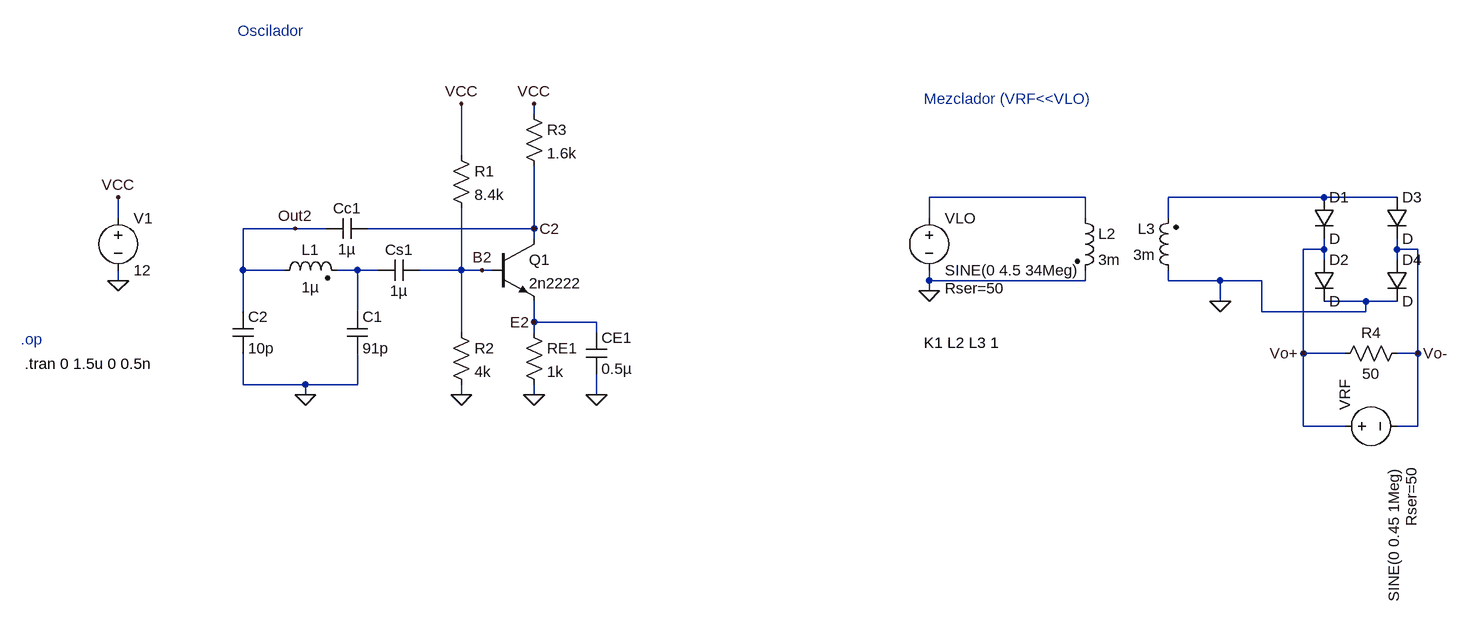
[diagram p0: schematic Draft2.asc]
Draft2.asc, the LTspice schematic file:
Version 4
SHEET 1 2084 680
WIRE 688 -80 688 -96
WIRE 576 -16 576 -96
WIRE 1536 48 1296 48
WIRE 1904 48 1664 48
WIRE 2016 48 1904 48
WIRE 48 80 48 48
WIRE 1296 80 1296 48
WIRE 1536 80 1536 48
WIRE 1664 80 1664 48
WIRE 320 96 240 96
WIRE 368 96 320 96
WIRE 688 96 688 0
WIRE 688 96 432 96
WIRE 688 112 688 96
WIRE 1904 128 1904 112
WIRE 1904 128 1872 128
WIRE 2016 128 2016 112
WIRE 2048 128 2016 128
WIRE 1904 144 1904 128
WIRE 2016 144 2016 128
WIRE 240 160 240 96
WIRE 304 160 240 160
WIRE 416 160 384 160
WIRE 448 160 416 160
WIRE 576 160 576 64
WIRE 576 160 512 160
WIRE 608 160 576 160
WIRE 624 160 608 160
WIRE 48 176 48 160
WIRE 1296 176 1296 160
WIRE 1536 176 1536 160
WIRE 1536 176 1296 176
WIRE 1664 176 1664 160
WIRE 1744 176 1664 176
WIRE 1808 176 1744 176
WIRE 1296 192 1296 176
WIRE 1744 208 1744 176
WIRE 1968 208 1904 208
WIRE 2016 208 1968 208
WIRE 240 224 240 160
WIRE 416 224 416 160
WIRE 1808 224 1808 176
WIRE 1968 224 1968 208
WIRE 1968 224 1808 224
WIRE 688 240 688 208
WIRE 784 240 688 240
WIRE 576 256 576 160
WIRE 688 256 688 240
WIRE 784 256 784 240
WIRE 1872 288 1872 128
WIRE 1936 288 1872 288
WIRE 2048 288 2048 128
WIRE 2048 288 2016 288
WIRE 240 336 240 288
WIRE 336 336 240 336
WIRE 416 336 416 288
WIRE 416 336 336 336
WIRE 336 352 336 336
WIRE 576 352 576 336
WIRE 688 352 688 336
WIRE 784 352 784 320
WIRE 1872 400 1872 288
WIRE 1936 400 1872 400
WIRE 2048 400 2048 288
WIRE 2048 400 2016 400
FLAG 48 176 0
FLAG 48 48 VCC
FLAG 576 352 0
FLAG 688 352 0
FLAG 576 -96 VCC
FLAG 688 -96 VCC
FLAG 336 352 0
FLAG 688 96 C2
FLAG 608 160 B2
FLAG 688 240 E2
FLAG 784 352 0
FLAG 320 96 Out2
FLAG 1296 192 0
FLAG 1744 208 0
FLAG 1872 288 Vo+
FLAG 2048 288 Vo-
SYMBOL voltage 48 64 R0
WINDOW 123 0 0 Left 0
WINDOW 39 0 0 Left 0
SYMATTR InstName V1
SYMATTR Value 12
SYMBOL npn 624 112 R0
SYMATTR InstName Q1
SYMATTR Value 2n2222
SYMBOL res 560 -32 R0
SYMATTR InstName R1
SYMATTR Value 8.4k
SYMBOL res 560 240 R0
SYMATTR InstName R2
SYMATTR Value 4k
SYMBOL res 672 240 R0
SYMATTR InstName RE1
SYMATTR Value 1k
SYMBOL cap 432 80 R90
WINDOW 0 0 32 VBottom 2
WINDOW 3 32 32 VTop 2
SYMATTR InstName Cc1
SYMATTR Value 1µ
SYMBOL cap 512 144 R90
WINDOW 0 0 32 VBottom 2
WINDOW 3 32 32 VTop 2
SYMATTR InstName Cs1
SYMATTR Value 1µ
SYMBOL cap 400 224 R0
SYMATTR InstName C1
SYMATTR Value 91p
SYMBOL ind2 288 176 R270
WINDOW 0 32 56 VTop 2
WINDOW 3 5 56 VBottom 2
SYMATTR InstName L1
SYMATTR Value 1µ
SYMATTR Type ind
SYMATTR SpiceLine Rser=1
SYMBOL cap 224 224 R0
SYMATTR InstName C2
SYMATTR Value 10p
SYMBOL cap 768 256 R0
SYMATTR InstName CE1
SYMATTR Value 0.5µ
SYMBOL res 672 -96 R0
SYMATTR InstName R3
SYMATTR Value 1.6k
SYMBOL ind2 1520 64 R0
SYMATTR InstName L2
SYMATTR Value 3m
SYMATTR Type ind
SYMBOL ind2 1680 176 R180
WINDOW 0 36 80 Left 2
WINDOW 3 36 40 Left 2
SYMATTR InstName L3
SYMATTR Value 3m
SYMATTR Type ind
SYMBOL voltage 1296 64 R0
WINDOW 123 0 0 Left 0
WINDOW 39 24 124 Left 2
SYMATTR InstName VLO
SYMATTR Value SINE(0 4.5 34Meg)
SYMATTR SpiceLine Rser=50
SYMBOL diode 1888 48 R0
SYMATTR InstName D1
SYMBOL diode 1888 144 R0
SYMATTR InstName D2
SYMBOL diode 2000 48 R0
SYMATTR InstName D3
SYMBOL diode 2000 144 R0
SYMATTR InstName D4
SYMBOL voltage 1920 400 R270
WINDOW 3 -270 91 Left 2
WINDOW 123 0 0 Left 0
WINDOW 39 -155 118 Left 2
SYMATTR InstName VRF
SYMATTR Value SINE(0 0.45 1Meg)
SYMATTR SpiceLine Rser=50
SYMBOL res 2032 272 R90
WINDOW 0 0 56 VBottom 2
WINDOW 3 32 56 VTop 2
SYMATTR InstName R4
SYMATTR Value 50
TEXT -102 266 Left 2 ;.op
TEXT -96 304 Left 2 !.tran 0 1.5u 0 0.5n
TEXT 1288 272 Left 2 !K1 L2 L3 1
TEXT 232 -208 Left 2 ;Oscilador
TEXT 1288 -104 Left 2 ;Mezclador (VRF<<VLO)

The netlist it stands for:
* Draft2.asc
V1 VCC 0 12
Q1 C2 B2 E2 0 2n2222
R1 VCC B2 8.4k
R2 B2 0 4k
RE1 E2 0 1k
Cc1 C2 Out2 1µ
Cs1 B2 N003 1µ
C1 N003 0 91p
L1 Out2 N003 1µ Rser=1
C2 Out2 0 10p
CE1 E2 0 0.5µ
R3 VCC C2 1.6k
L2 N001 0 3m
L3 0 N002 3m
VLO N001 0 SINE(0 4.5 34Meg) Rser=50
D1 N002 Vo+ D
D2 Vo+ 0 D
D3 N002 Vo- D
D4 Vo- 0 D
VRF Vo+ Vo- SINE(0 0.45 1Meg) Rser=50
R4 Vo- Vo+ 50
.model D D
.lib standard.dio
.model NPN NPN
.model PNP PNP
.lib standard.bjt
* .op
.tran 0 1.5u 0 0.5n
K1 L2 L3 1
* Oscilador
* Mezclador (VRF<<VLO)
.backanno
.end